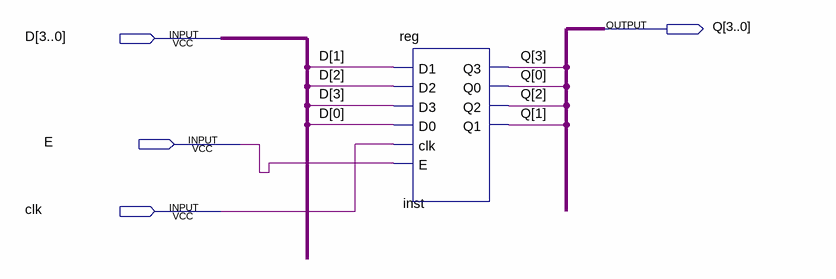
[diagram p0: schematic sheet]
// Quartus schematic register.bdf as structural Verilog: 1 symbols, 4 pins
module register (
  input  [3:0] D,
  input  E,
  input  clk,
  output [3:0] Q
);

  \reg  inst (.D1(D[1]), .D2(D[2]), .D3(D[3]), .D0(D[0]), .clk(clk), .E(E), .Q3(Q[3]), .Q0(Q[0]), .Q2(Q[2]), .Q1(Q[1]));
endmodule
